# EAGLE design GettingStarted (EAGLE 9.4.2)
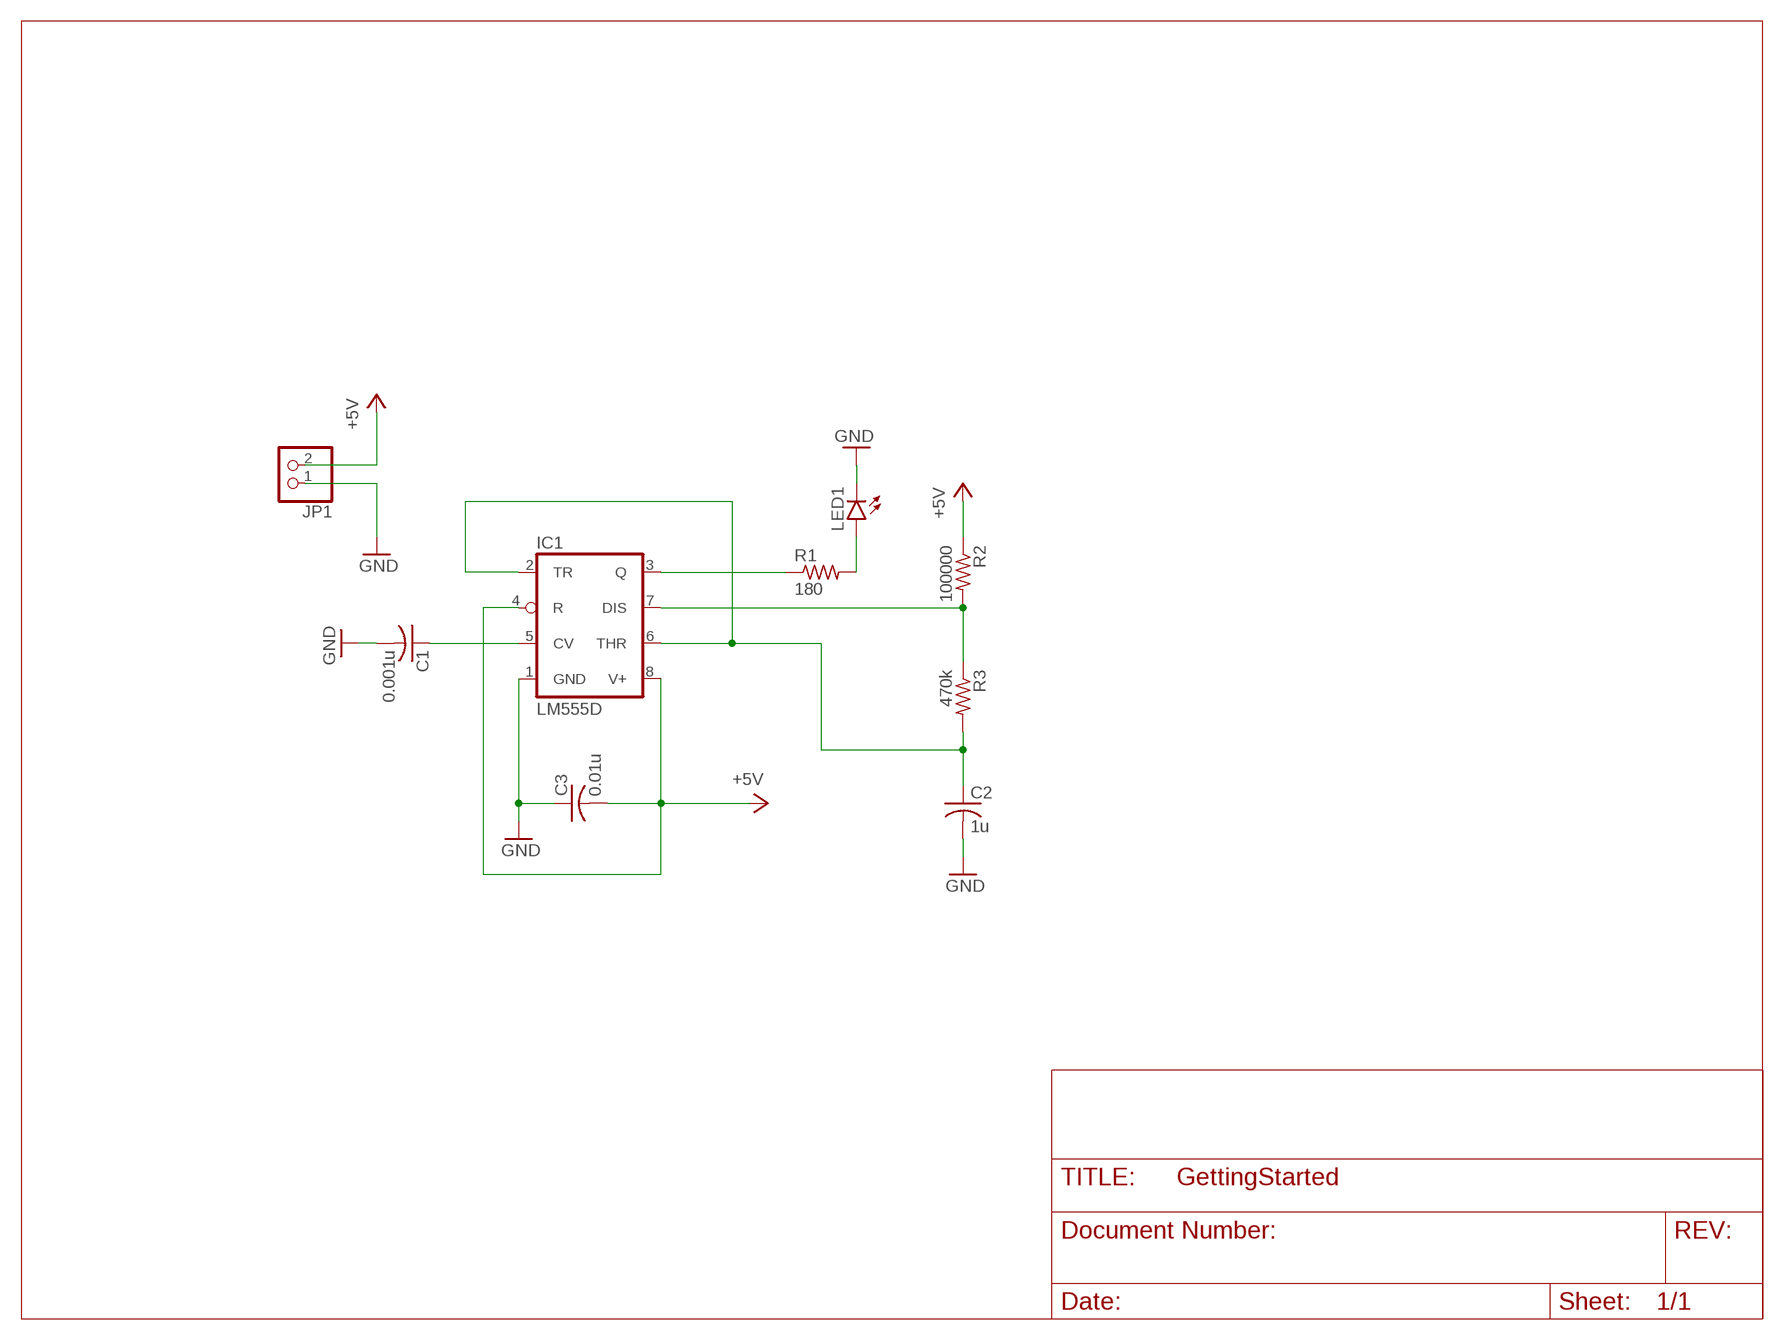
[diagram p0: schematic, sheet 1]

## Parts
C1  0.001u  C-USC0805  [C0805]
C2  1u  C-USC0805  [C0805]
C3  0.01u  C-USC0805  [C0805]
IC1  LM555D  [SO08]
JP1  PINHD-1X2  [1X02]
LED1  LED5MM  [LED5MM]
R1  180  R-US_R0805  [R0805]
R2  100000  R-US_R0805  [R0805]
R3  470k  R-US_R0805  [R0805]

## Nets
+5V: C3.2 IC1.4(R) IC1.8(V+) JP1.2 R2.1
GND: C1.2 C2.2 C3.1 IC1.1(GND) JP1.1 LED1.K(C)
N$1: IC1.3(Q) R1.1
N$2: IC1.7(DIS) R2.2 R3.1
N$3: C2.1 IC1.2(TR) IC1.6(THR) R3.2
N$4: LED1.A R1.2
N$5: C1.1 IC1.5(CV)

## Library data of the parts
C1-C3 = rcl:C-US: CAPACITOR, American symbol; SPICEPREFIX: C
IC1 = linear:*555: TIMER
JP1 = pinhead:PINHD-1X2: PIN HEADER
LED1 = led:LED: LED OSRAM: - CHIPLED LG R971, LG N971, LY N971, LG Q971, LY Q971, LO R971, LY R971 LH N974, LH R974 LS Q976, LO Q976, LY Q976 LO Q996 - Hyper CHIPLED LW Q18S LB Q993, LB Q99A, LB R99A - SideLED LS A670, LO A670, LY A670, LG A670, LP A670 LB A673, LV A673, LT A673, LW A673 LH A674 LY A675 LS A676, LA A676, LO A676, LY A676, LW A676 LS A679, LY A679, LG A679 - Hyper Micro SIDELED® LS Y876, LA Y876, LO Y876, LY Y876 LT Y87S - SmartLED LW L88C, LW L88S LB L89C, LB L89S, LG L890 LS L89K, LO L89K, LY L89K LS L896, LA L896, LO L896, LY L896 - TOPLED LS T670, LO T670, LY T670, LG T670, LP T670 LSG T670, LSP T670, LSY T670, LOP T670, LYG T670 LG T671, LOG T671, LSG T671 LB T673, LV T673, LT T673, LW T673 LH T674 LS T676, LA T676, LO T676, LY T676, LB T676, LH T676, LSB T676, LW T676 LB T67C, LV T67C, LT T67C, LS T67K, LO T67K, LY T67K, LW E67C LS E67B, LA E67B, LO E67B, LY E67B, LB E67C, LV E67C, LT E67C LW T67C LS T679, LY T679, LG T679 LS T770, LO T770, LY T770, LG T770, LP T770 LB T773, LV T773, LT T773, LW T773 LH T774 LS E675, LA E675, LY E675, LS T675 LS T776, LA T776, LO T776, LY T776, LB T776 LHGB T686 LT T68C, LB T68C - Hyper Mini TOPLED® LB M676 - Mini TOPLED Santana® LG M470 LS M47K, LO M47K, LY M47K Source: http://www.osram.convergy.de LUXEON: - LUMILED® LXK2-PW12-R00, LXK2-PW12-S00, LXK2-PW14-U00, LXK2-PW14-V00 LXK2-PM12-R00, LXK2-PM12-S00, LXK2-PM14-U00 LXK2-PE12-Q00, LXK2-PE12-R00, LXK2-PE12-S00, LXK2-PE14-T00, LXK2-PE14-U00 LXK2-PB12-K00, LXK2-PB12-L00, LXK2-PB12-M00, LXK2-PB14-N00, LXK2-PB14-P00, LXK2-PB14-Q00 LXK2-PR12-L00, LXK2-PR12-M00, LXK2-PR14-Q00, LXK2-PR14-R00 LXK2-PD12-Q00, LXK2-PD12-R00, LXK2-PD12-S00 LXK2-PH12-R00, LXK2-PH12-S00 LXK2-PL12-P00, LXK2-PL12-Q00, LXK2-PL12-R00 Source: www.luxeon.com KINGBRIGHT: KA-3528ASYC Source: www.kingbright.com
R1-R3 = rcl:R-US_: RESISTOR, American symbol; SPICEPREFIX: R

## Board
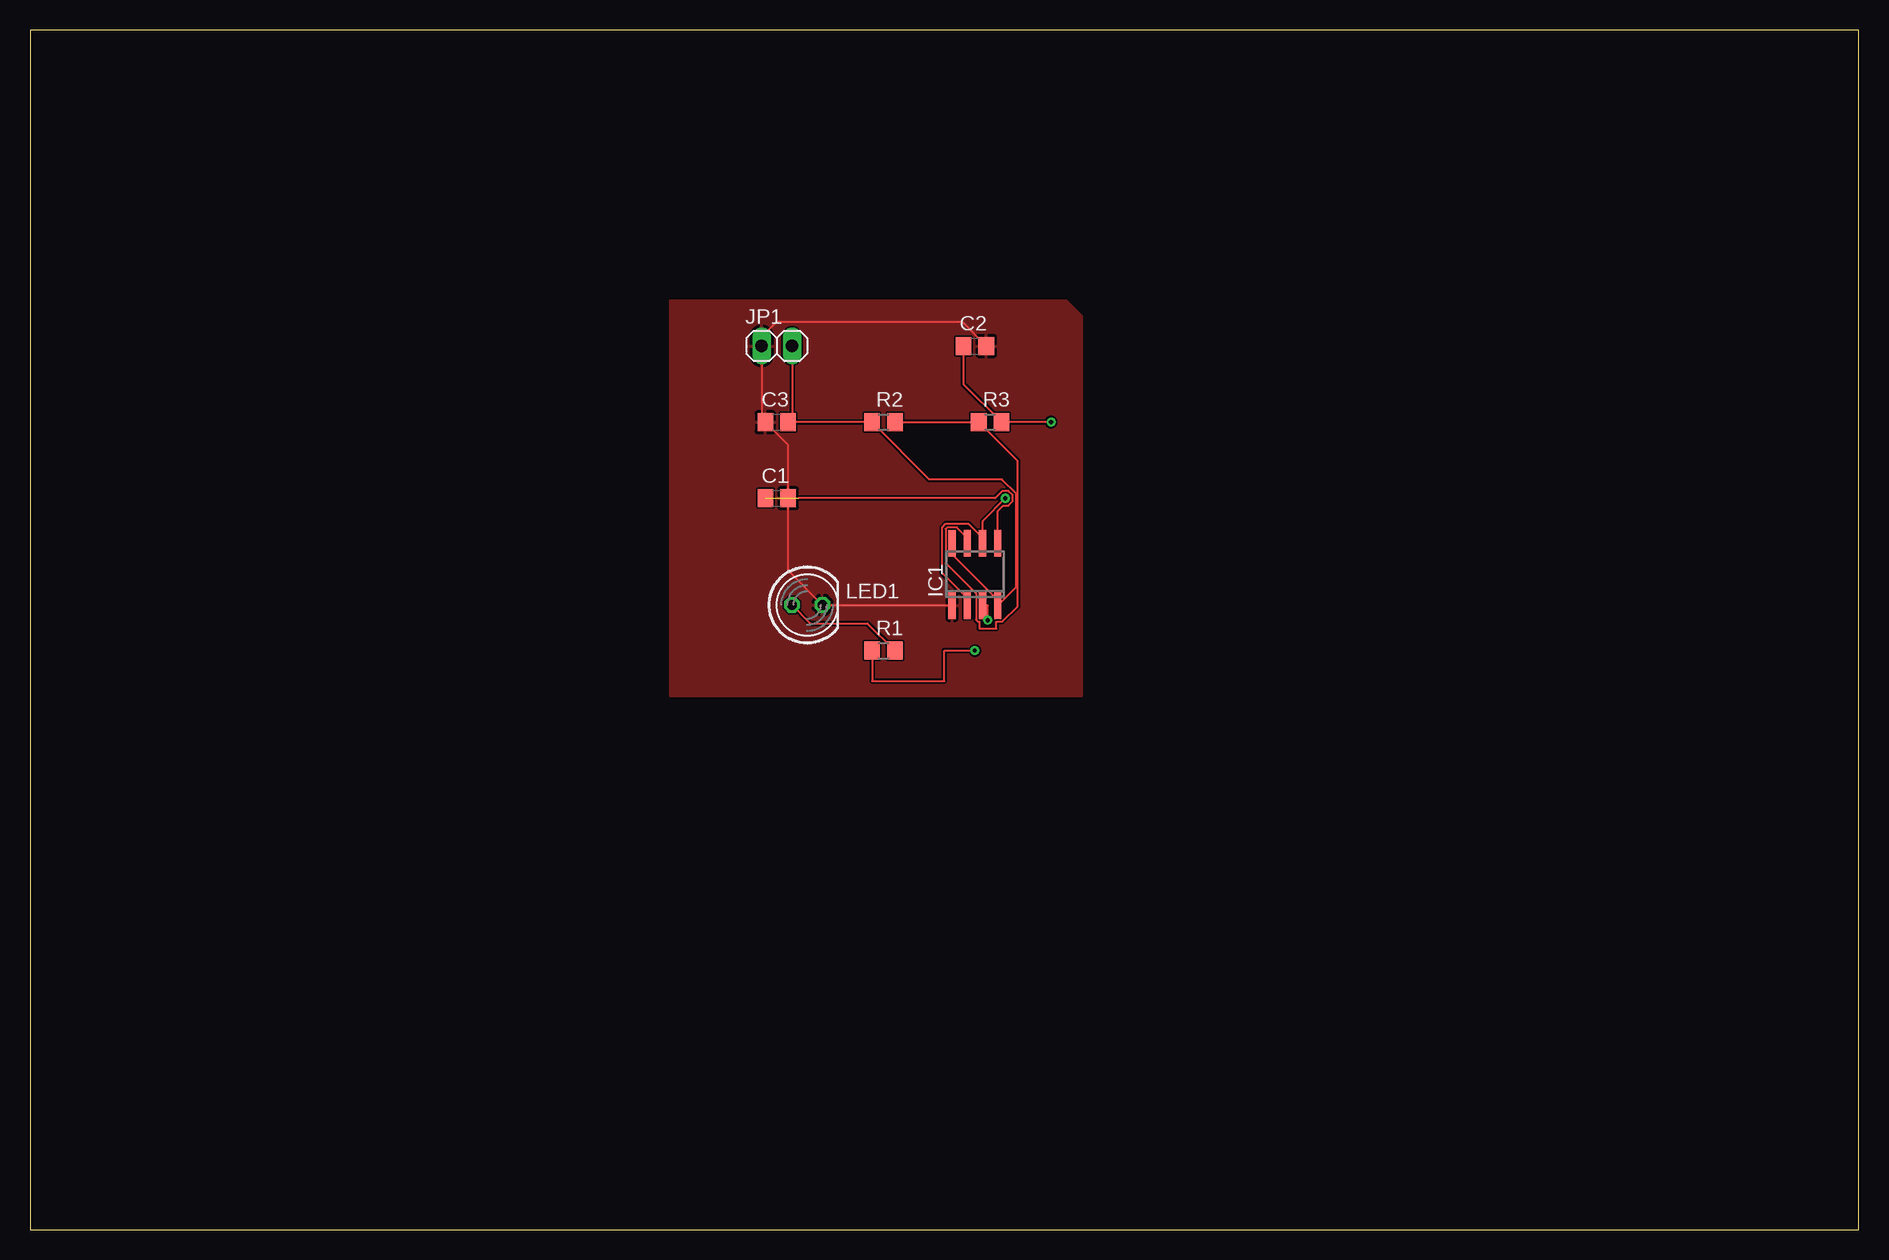
[diagram p1: board, top side]
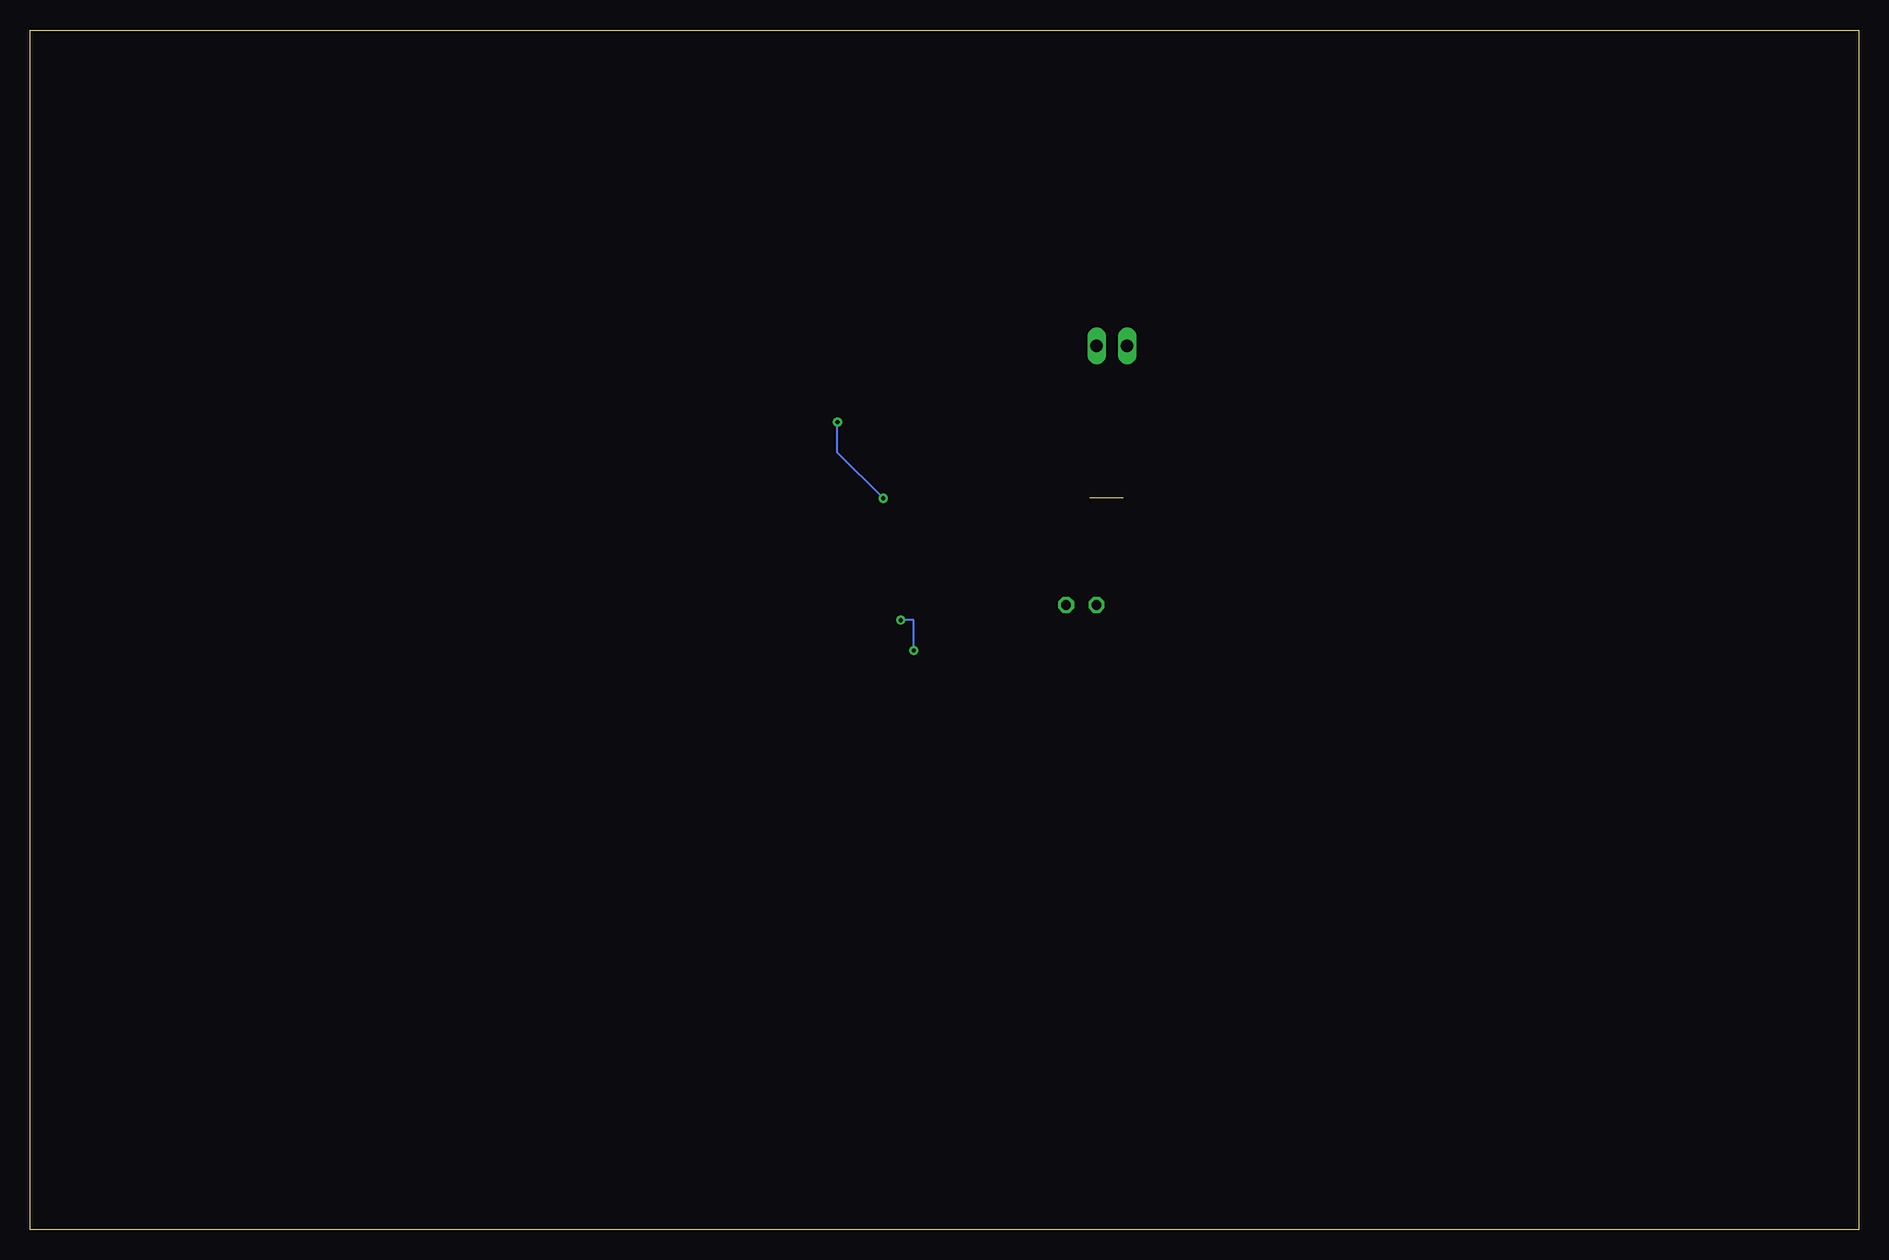
[diagram p2: board, bottom side, seen from below]

Size 152.38 x 100 mm. Coordinates in mm from the lower left corner, seen from the top.
Outline: 0,0 152.38,0 152.38,100 0,100 0,0
Copper layers (1*16): Top 0.035mm / dielectric 1.5mm / Bottom 0.035mm
Design rules "default": minimum track width 6mil, minimum drill 0.35mm, track to track 6mil, track to pad 6mil, pad to pad 6mil, via to via 6mil, smd to smd 6mil, copper to edge 40mil, drill to drill 6mil, minimum pad ring 10mil, minimum via ring 8mil, stop-mask expansion 4mil, vias tented up to drill 0mil, thermal gap 10mil

### Footprints (pad centres in the part's own frame; a part is rotated, then mirrored left to right if it is on the bottom)
C0805 = smd 1.3 x 1.5: 1 -0.95,0; 2 0.95,0
SO08 = smd 0.6 x 2.2: 1 -1.905,-2.6; 2 -0.635,-2.6; 3 0.635,-2.6; 4 1.905,-2.6; 5 1.905,2.6; 6 0.635,2.6; 7 -0.635,2.6; 8 -1.905,2.6
1X02 = drill 1.016 long: 1 -1.27,0; 2 1.27,0
LED5MM = drill 0.813 octagon: A -1.27,0; K 1.27,0
R0805 = smd 1.3 x 1.5: 1 -0.95,0; 2 0.95,0

### Placement (x,y rotation side)
C1  62.23,60.96 0 top
C2  78.74,73.66 0 top
C3  62.23,67.31 0 top
IC1  78.74,54.61 0 top
JP1  62.23,73.66 0 top
LED1  64.77,52.07 0 top
R1  71.12,48.26 0 top
R2  71.12,67.31 0 top
R3  80.01,67.31 0 top

### Tracks (layer width: path | path; a pad name or v marks a point on that pad's centre or on a via)
+5V
  Top 0.152: IC1.8 76.83,56.28 80.64,52.48 IC1.4 82.19,53.56 82.19,61.34 80.99,62.54 74.94,62.54 R2.1 C3.2 63.5,67.63 63.5,72.9 JP1.2
GND
  Top 0.152: IC1.1 76.78,52.07 LED1.K 63.18,54.93 C1.2 63.18,65.41 C3.1 60.96,67.63 60.96,72.9 JP1.1 60.96,74.42 62.18,75.64 77.71,75.64 C2.2
  pour Top: 53.34,77.47 86.36,77.47 87.63,76.2 87.63,44.45 53.34,44.45
N$1  (via drill 0.35)
  Top 0.152: R1.1 70.17,45.72 76.2,45.72 76.2,48.26 v78.74,48.26 | v79.81,50.8 79.81,52.01 IC1.3
  Bottom 0.152: v78.74,48.26 78.74,50.8 v79.81,50.8
N$2
  Top 0.152: R2.2 R3.1 82.3,64.07 82.3,51.94 81.04,50.68 80.52,50.68 80.52,50.09 79.11,50.09 79.11,50.68 78.98,50.68 78.85,50.81 78.85,53 76.31,55.54 76.31,58.41 76.44,58.54 77.23,58.54 78.11,57.66 IC1.7
N$3  (via drill 0.35)
  Top 0.152: v81.28,60.96 79.38,59.05 IC1.6 79.38,57.66 78.19,58.84 76.31,58.84 76,58.53 76,54.75 78.11,52.64 IC1.2 | v85.09,67.31 R3.2 77.79,70.48 C2.1
  Bottom 0.152: v81.28,60.96 85.09,64.77 v85.09,67.31
N$4
  Top 0.152: LED1.A 65.03,50.54 69.79,50.54 R1.2
N$5  (1 unrouted)
  Top 0.152: IC1.5 80.64,59.89 81.1,60.35 81.53,60.35 81.89,60.71 81.89,61.21 81.53,61.57 81.03,61.57 80.42,60.96 64.06,60.96